# Altium schematic sheet ESP-01F.SchDoc
size A2
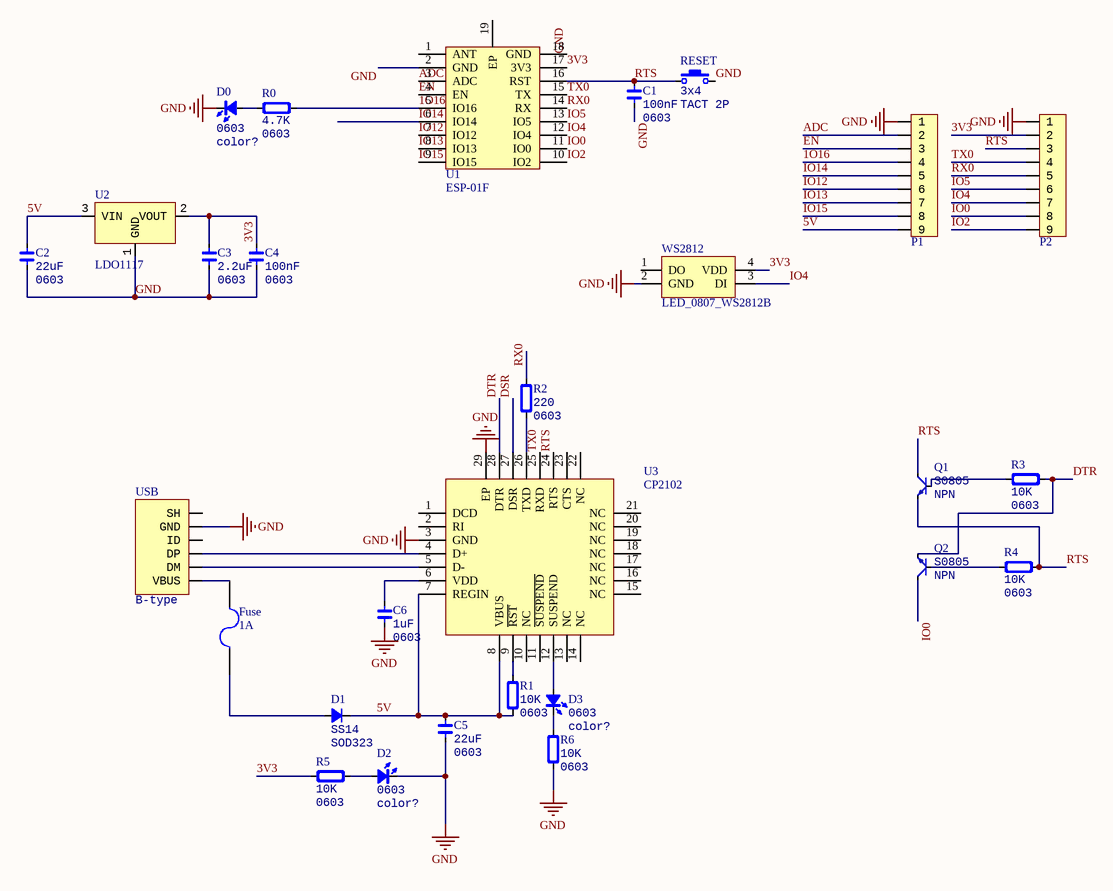
[diagram p0: ESP-01F.SchDoc]

## Parts
C1  value 100nF  Type: 0603  [CAP_0603]  (hidden comment: C0603)
C2  value 22uF  Type: 0603  [CAP_0603]  (hidden comment: C0603)
C3  value 2.2uF  Type: 0603  [CAP_0603]  (hidden comment: C0603)
C4  value 100nF  Type: 0603  [CAP_0603]  (hidden comment: C0603)
C5  value 22uF  Type: 0603  [CAP_0603]  (hidden comment: C0603)
C6  value 1uF  Type: 0603  [CAP_0603]  (hidden comment: C0603)
D0  Type: 0603  [LED_0603_RED]  (hidden comment: color?)
D1  Type: SOD323  [SOD-323]  (hidden comment: SS14)
D2  Type: 0603  [LED_0603_RED]  (hidden comment: color?)
D3  Type: 0603  [LED_0603_RED]  (hidden comment: color?)
Fuse  value 1A  [1206]  (hidden comment: Fuse)
P1  HDR1x9.54  [HDR1X9_2.54_180]  (value not drawn)
P2  HDR1x9.54  [HDR1X9_2.54_180]  (value not drawn)
Q1  Type: NPN  [SOT23-3]  (hidden comment: S0805)
Q2  Type: NPN  [SOT23-3]  (hidden comment: S0805)
R0  value 4.7K  Type: 0603  [RES_0603]  (hidden comment: R0603)
R1  value 10K  Type: 0603  [RES_0603]  (hidden comment: R0603)
R2  value 220  Type: 0603  [RES_0603]  (hidden comment: R0603)
R3  value 10K  Type: 0603  [RES_0603]  (hidden comment: R0603)
R4  value 10K  Type: 0603  [RES_0603]  (hidden comment: R0603)
R5  value 10K  Type: 0603  [RES_0603]  (hidden comment: R0603)
R6  value 10K  Type: 0603  [RES_0603]  (hidden comment: R0603)
RESET  value 3x4  [ButtonTACT_3x4x2_180]  (hidden comment: TACT 2P)
U1  ESP-01F  [ESP-01F]
U2  LDO1117  [SOT89-3]
U3  CP2102  [QFN28,5X5]
USB  Type: B-type  [USB_Micro-AB]  (hidden comment: MicroUSB)
WS2812  LED_0807_WS2812B  [WS28112_0807]

## Nets
GND: C1.1 C2.1 C3.1 C4.1 C5.1 C6.1 D0.2(K) D2.2(K) P1.1 P2.1 R6.1 RESET.2 U1.2(GND) U1.18(GND) U2.1(GND) U3.3(GND) U3.29(EP) USB.5(GND) WS2812.2(GND)
1O16: P1.4 R0.1 U1.5(IO16)
3V3: C3.2 C4.2 P2.2 R5.2 U1.17(3V3) U2.2(VOUT) WS2812.4(VDD)
5V: C2.2 C5.2 D1.2(K) P1.9 R1.1 U2.3(VIN) U3.7(REGIN) U3.8(VBUS)
ADC: P1.2 U1.3(ADC)
DSR: U3.27(DSR)
DTR: Q2.2(E) R3.1 U3.28(DTR)
EN: P1.3 U1.4(EN)
IO0: P2.8 Q2.3(C) U1.11(IO0)
IO2: P2.9 U1.10(IO2)
IO4: P2.7 U1.12(IO4) WS2812.3(DI)
IO5: P2.6 U1.13(IO5)
IO12: P1.6 U1.7(IO12)
IO13: P1.7 U1.8(IO13)
IO14: P1.5 U1.6(IO14)
IO15: P1.8 U1.9(IO15)
RTS: C1.2 P2.3 Q1.2(E) Q1.3(C) R4.1 RESET.1 U1.16(RST) U3.24(RTS)
RX0: P2.5 R2.2 U1.14(RX)
TX0: P2.4 U1.15(TX) U3.25(RXD)
NetC6_2: C6.2 U3.6(VDD)
NetD0_1: D0.1(A) R0.2
NetD1_1: D1.1(A) Fuse.1
NetD2_1: D2.1(A) R5.1
NetD3_1: D3.1(A) U3.12(SUSPEND)
NetD3_2: D3.2(K) R6.2
NetFuse_2: Fuse.2 USB.1(VBUS)
NetQ1_1: Q1.1(B) R3.2
NetQ2_1: Q2.1(B) R4.2
NetR1_2: R1.2 U3.9(~{RST})
NetR2_1: R2.1 U3.26(TXD)
NetU3_4: U3.4(D+) USB.3(DP)
NetU3_5: U3.5(D-) USB.2(DM)

Not connected (* = marked no-connect by the designer): U1 1(ANT) 19(EP); U3 1(DCD) 2(RI) 10(NC) 11(~{SUSPEND}) 13(NC) 14(NC) 15(NC) 16(NC) 17(NC) 18(NC) 19(NC) 20(NC) 21(NC) 22(NC) 23(CTS); USB 0(SH) 4(ID); WS2812 1(DO)

## Library data of the parts
C1-C6 = Cap_0603: Capacitor; Specification: X7R 50V; Manufacturer: *
D0 D2 D3 = LED_0603: LED; Value: color?
D1 = Diode_SOD323: Diode; Value: SS14
Fuse = Fuse 2: 保险丝; Published: 8-Jun-2000; LatestRevisionDate: 17-Jul-2002; LatestRevisionNote: Re-released for DXP Platform.; PackageReference: PIN-W2/E2.8; Publisher: Altium Limited
P1 P2 = HDR1x9_2.54: Header
Q1 Q2 = BJT_NPN: Transistor; Value: S0805
R0-R6 = Res_0603: Resistor; Specification: ±5%; Manufacturer: *
RESET = ButtonTACT_3x4x2_180: Button; type: TACT 2P
U2 = LDO1117: Power; Type: SOT223-3
USB = USB_Micro: USB